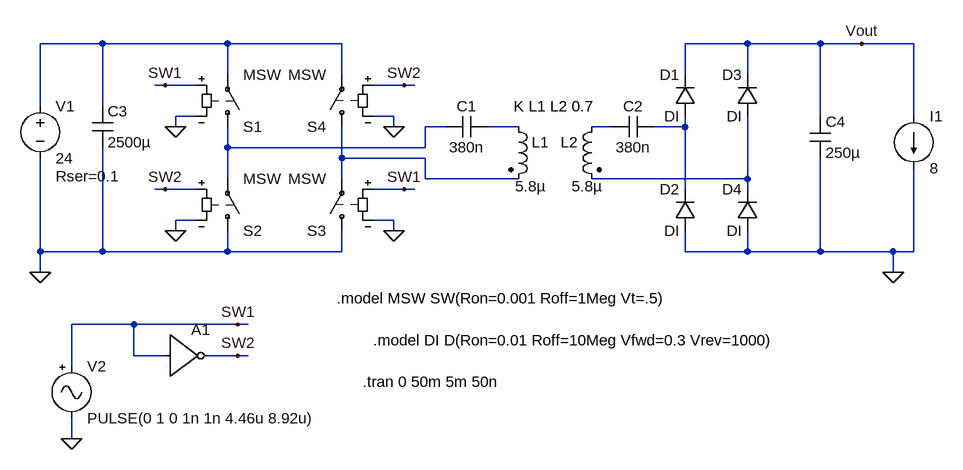
[diagram p0: schematic Full Bridge Simple.asc]
Full Bridge Simple.asc, the LTspice schematic file:
Version 4
SHEET 1 1264 744
WIRE -64 96 -160 96
WIRE 128 96 -64 96
WIRE 304 96 128 96
WIRE 928 96 832 96
WIRE 1040 96 928 96
WIRE 1104 96 1040 96
WIRE 1184 96 1104 96
WIRE 128 144 128 96
WIRE 304 144 304 96
WIRE 832 144 832 96
WIRE 928 144 928 96
WIRE 32 160 16 160
WIRE 80 160 32 160
WIRE 400 160 352 160
WIRE 416 160 400 160
WIRE -160 192 -160 96
WIRE -64 192 -64 96
WIRE 80 208 48 208
WIRE 384 208 352 208
WIRE 1040 208 1040 96
WIRE 1184 208 1184 96
WIRE 48 224 48 208
WIRE 384 224 384 208
WIRE 464 224 432 224
WIRE 576 224 528 224
WIRE 720 224 688 224
WIRE 832 224 832 208
WIRE 832 224 784 224
WIRE 128 256 128 224
WIRE 432 256 432 224
WIRE 432 256 128 256
WIRE 304 272 304 224
WIRE 432 272 304 272
WIRE 128 304 128 256
WIRE 304 304 304 272
WIRE 432 304 432 272
WIRE 576 304 432 304
WIRE 928 304 928 208
WIRE 928 304 688 304
WIRE 32 320 16 320
WIRE 80 320 32 320
WIRE 400 320 352 320
WIRE 416 320 400 320
WIRE 832 320 832 224
WIRE 928 320 928 304
WIRE 80 368 48 368
WIRE 384 368 352 368
WIRE 48 384 48 368
WIRE 384 384 384 368
WIRE -160 416 -160 272
WIRE -64 416 -64 256
WIRE -64 416 -160 416
WIRE 128 416 128 384
WIRE 128 416 -64 416
WIRE 304 416 304 384
WIRE 304 416 128 416
WIRE 832 416 832 384
WIRE 928 416 928 384
WIRE 928 416 832 416
WIRE 1040 416 1040 272
WIRE 1040 416 928 416
WIRE 1152 416 1040 416
WIRE 1184 416 1184 288
WIRE 1184 416 1152 416
WIRE -160 448 -160 416
WIRE 1152 448 1152 416
WIRE -16 528 -112 528
WIRE 144 528 -16 528
WIRE 160 528 144 528
WIRE -16 576 -16 528
WIRE 32 576 -16 576
WIRE 144 576 96 576
WIRE 160 576 144 576
WIRE -112 592 -112 528
WIRE -112 704 -112 672
FLAG 48 224 0
FLAG 48 384 0
FLAG 384 224 0
FLAG 384 384 0
FLAG 32 160 SW1
FLAG 400 320 SW1
FLAG 32 320 SW2
FLAG 400 160 SW2
FLAG 1104 96 Vout
FLAG -160 448 0
FLAG -112 704 0
FLAG 144 528 SW1
FLAG 144 576 SW2
FLAG 1152 448 0
SYMBOL sw 128 240 M180
SYMATTR InstName S1
SYMATTR Value MSW
SYMBOL sw 128 400 M180
SYMATTR InstName S2
SYMATTR Value MSW
SYMBOL sw 304 400 R180
SYMATTR InstName S3
SYMATTR Value MSW
SYMBOL sw 304 240 R180
SYMATTR InstName S4
SYMATTR Value MSW
SYMBOL cap -80 192 R0
SYMATTR InstName C3
SYMATTR Value 2500µ
SYMATTR SpiceLine Rser=0.001 Lser=1n
SYMBOL voltage -160 176 R0
WINDOW 123 0 0 Left 0
WINDOW 39 24 124 Left 2
SYMATTR SpiceLine Rser=0.1
SYMATTR InstName V1
SYMATTR Value 24
SYMBOL ind2 560 208 R0
WINDOW 3 11 107 Left 2
SYMATTR Value 5.8µ
SYMATTR InstName L1
SYMATTR Type ind
SYMATTR SpiceLine Rser=12m
SYMBOL ind2 704 208 M0
WINDOW 3 -1 107 Left 2
SYMATTR Value 5.8µ
SYMATTR InstName L2
SYMATTR Type ind
SYMATTR SpiceLine Rser=12m
SYMBOL diode 848 208 R180
WINDOW 0 24 64 Left 2
WINDOW 3 24 0 Left 2
SYMATTR InstName D1
SYMATTR Value DI
SYMBOL diode 848 384 R180
WINDOW 0 24 64 Left 2
WINDOW 3 24 0 Left 2
SYMATTR InstName D2
SYMATTR Value DI
SYMBOL diode 944 208 R180
WINDOW 0 24 64 Left 2
WINDOW 3 24 0 Left 2
SYMATTR InstName D3
SYMATTR Value DI
SYMBOL diode 944 384 R180
WINDOW 0 24 64 Left 2
WINDOW 3 24 0 Left 2
SYMATTR InstName D4
SYMATTR Value DI
SYMBOL cap 1024 208 R0
SYMATTR InstName C4
SYMATTR Value 250µ
SYMATTR SpiceLine Rser=0.01 Lser=1n
SYMBOL Misc\\signal -112 576 R0
WINDOW 123 0 0 Left 0
WINDOW 39 0 0 Left 0
SYMATTR InstName V2
SYMATTR Value PULSE(0 1 0 1n 1n 4.46u 8.92u)
SYMBOL Digital\\inv 32 512 R0
SYMATTR InstName A1
SYMBOL current 1184 208 R0
WINDOW 123 0 0 Left 0
WINDOW 39 0 0 Left 0
SYMATTR InstName I1
SYMATTR Value 8
SYMBOL cap 528 208 R90
WINDOW 0 0 32 VBottom 2
WINDOW 3 32 32 VTop 2
SYMATTR InstName C1
SYMATTR Value 380n
SYMATTR SpiceLine Rser=10m
SYMBOL cap 784 208 R90
WINDOW 0 0 32 VBottom 2
WINDOW 3 32 32 VTop 2
SYMATTR InstName C2
SYMATTR Value 380n
SYMATTR SpiceLine Rser=10m
TEXT 568 192 Left 2 !K L1 L2 0.7
TEXT 336 616 Left 2 !.tran 0 50m 5m 50n
TEXT 296 488 Left 2 !.model MSW SW(Ron=0.001 Roff=1Meg Vt=.5)
TEXT 352 552 Left 2 !.model DI D(Ron=0.01 Roff=10Meg Vfwd=0.3 Vrev=1000)

The netlist it stands for:
* Full Bridge Simple.asc
S1 N002 N001 SW1 0 MSW
S2 0 N002 SW2 0 MSW
S3 0 N006 SW1 0 MSW
S4 N006 N001 SW2 0 MSW
C3 N001 0 2500µ Rser=0.001 Lser=1n
V1 N001 0 24 Rser=0.1
L1 N003 N006 5.8µ Rser=12m
L2 N004 N007 5.8µ Rser=12m
D1 N005 Vout DI
D2 0 N005 DI
D3 N007 Vout DI
D4 0 N007 DI
C4 Vout 0 250µ Rser=0.01 Lser=1n
V2 SW1 0 PULSE(0 1 0 1n 1n 4.46u 8.92u)
A1 SW1 0 0 0 0 SW2 0 0 BUF
I1 Vout 0 8
C1 N003 N002 380n Rser=10m
C2 N005 N004 380n Rser=10m
.model D D
.lib standard.dio
K L1 L2 0.7
.tran 0 50m 5m 50n
.model MSW SW(Ron=0.001 Roff=1Meg Vt=.5)
.model DI D(Ron=0.01 Roff=10Meg Vfwd=0.3 Vrev=1000)
.backanno
.end